# Altium project BMW F800GS Board.PrjPcb
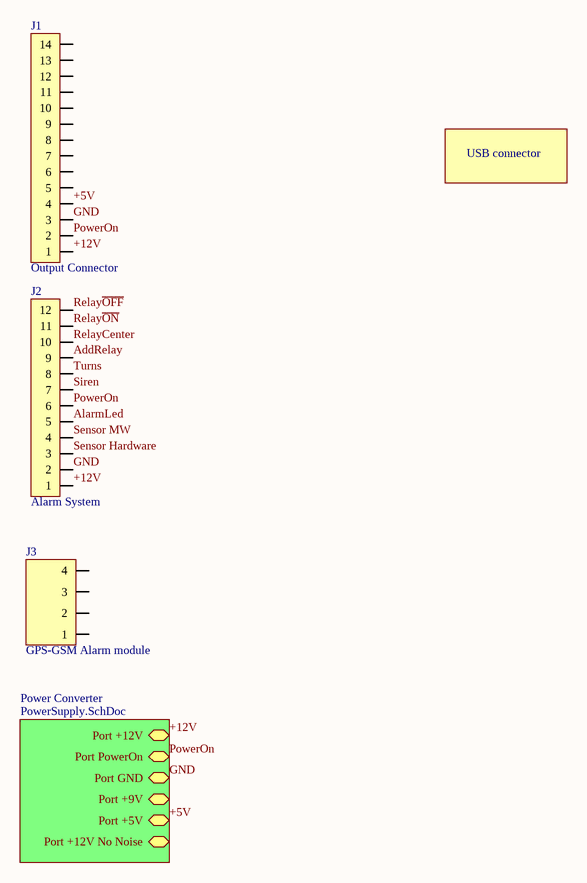
[diagram p0: BMW F800GS Board.SchDoc]
2 sheets, 16 parts. Net scope: hierarchical (ports join the sheet entries above them; power ports are global).
Board file: BMW F800GS Board.PcbDoc
Sheets:
  BMW F800GS Board.SchDoc
    Power Converter = PowerSupply.SchDoc

## Sheet BMW F800GS Board.SchDoc
size A4

### Parts
J1  Output Connector  [Molex Micro-Fit 3.0 - 14 pin D R]
J2  Alarm System  [Molex Micro-Fit 3.0 - 12 pin D R]
J3  GPS-GSM Alarm module  [Line 2.54 X 4]

### Sub-sheets
Power Converter = PowerSupply.SchDoc: Port +12V (bidir), Port GND (bidir), Port +9V (bidir), Port +5V (bidir), Port +12V No Noise, Port PowerOn

### Nets
GND: J1.3 J2.2 ; sheet Power Converter/Port GND
+5V: J1.4 ; sheet Power Converter/Port +5V
+12V: J1.1 J2.1 ; sheet Power Converter/Port +12V
AddRelay: J2.9
AlarmLed: J2.5
PowerOn: J1.2 J2.6 ; sheet Power Converter/Port PowerOn
RelayCenter: J2.10
Relay~{OFF}: J2.12
Relay~{ON}: J2.11
Sensor Hardware: J2.3
Sensor MW: J2.4
Siren: J2.7
Turns: J2.8

Not connected (* = marked no-connect by the designer): J1 5 6 7 8 9 10 11 12 13 14; J3 1 2 3 4

### Notes on the sheet
- USB connector

### Library data of the parts
J1 = Micro-Fit 14 (2x7): Horisontal, Dbl line, Male
J2 = Micro-Fit 12 (2x6): Horisontal, Dbl line, Male
J3 = PLS-4: Vert, Sgl line, Male

## Sheet PowerSupply.SchDoc
size A4
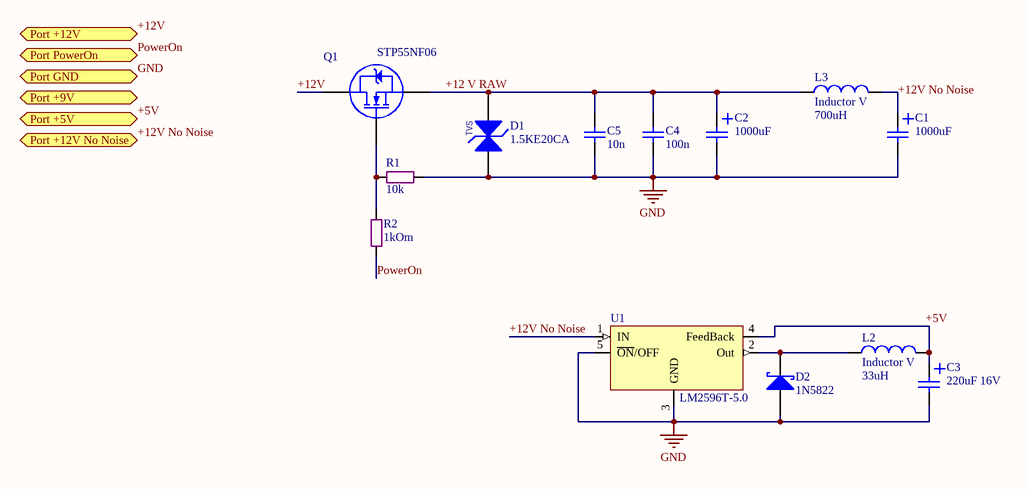
[diagram p1: PowerSupply.SchDoc]

### Parts
C1  1000uF  [Cap E p5.08mm D10.2mm (3p)]
C2  1000uF  [Cap E p5.08mm D10.2mm (3p)]
C3  220uF 16V  [Cap E p2mm D6.5xH11]
C4  100n  [Cap P5.08MM (3p) disk2]
C5  10n  [Cap P5.08MM (3p) disk2]
D1  1.5KE20CA  [TVS diode DO-201]
D2  1N5822  [Diode DO-201]
L2  Inductor V  value 33uH  [Toroid V D14-W6]
L3  Inductor V  value 700uH  [Toroid V D14-W6]
Q1  STP55NF06  [TO220-2 Horisontal]
R1  10k  [SMD 0805 (2012)]
R2  1kOm  [SMD 0805 (2012)]
U1  LM2596T-5.0  [TO220-5 Horisontal]

### Ports
Port +5V (bidir), Port +9V (bidir), Port +12V (in), Port +12V No Noise (bidir), Port GND (bidir), Port PowerOn (in)

### Nets
GND: C1.2 C2.2 C3.2 C4.2 C5.2 D1.1 D2.A R1.2 U1.3(GND) U1.5(~{ON}/OFF) ; port Port GND
+5V: C3.1 L2.2 U1.4(FeedBack) ; port Port +5V
+12 V RAW: C2.1 C4.1 C5.1 D1.2 L3.1 Q1.3(S)
+12V: Q1.2(D) ; port Port +12V
+12V No Noise: C1.1 L3.2 U1.1(IN) ; port Port +12V No Noise
PowerOn: R2.1 ; port Port PowerOn
NetD2_K: D2.K L2.1 U1.2(Out)
NetQ1_1: Q1.1(G) R1.1 R2.2

### Notes on the sheet
- (in symbol TVS 1.5KE20CA) TVS

### Library data of the parts
C1 C2 = Cap E 1000mF x 25V: Capacitor
C3 = Cap E 220mF x 16V: Capacitor; Value: 220mF 16v
C4 C5 = Cap Ceramic: Capacitor
D1 = TVS 1.5KE20CA: 1500W Transil (TVS Diode); Stand-Off V: 17.1; Load A: 5; Breakdown V: min 19 max 21; PackageReference: DO-201; Pulse Power: 1500W; VALUE: 1.5KE20CA
D2 = D Shotki 1N5822: 3 Amp Shotki  Diode; PackageReference: DO-201; VALUE: 1N5822
L2 L3 = Inductor V: Inductor Vertical; Code_IEC: 1005; Published: 8-Jun-2000; LatestRevisionDate: 29-May-2009; LatestRevisionNote: IPC-7351 Footprint Added.; PackageReference: 0402-A; Publisher: Altium Limited; PackageDescription: Chip Inductor; Code_JEITA: 0402
Q1 = STP55NF06: N-Channel 60V - 0.018Ω - 50A - D2PAK - I2PAK; Monufacturer: STP; V DSS (v): 60; RDS: <0.018Om; I d - Drain current (continuous) at TC = 25°C: 50 A; I d - Drain current (continuous) at TC = 100°C: 50 A; Name: STP55NF06
R1 R2 = Res SMD 0805
U1 = LM2596T-5.0: Voltage Regulator; Manufacturer: National Semiconductor; I output (A): 3; Max Voltage In (V): 40; Name: LM2596T-5.0; Case: TO220-5

## Nets that join several sheets
GND: BMW F800GS Board (J1.3 J2.2), PowerSupply (10 pins)
+5V: BMW F800GS Board (J1.4), PowerSupply (C3.1 L2.2 U1.4)
+12V: BMW F800GS Board (J1.1 J2.1), PowerSupply (Q1.2)
PowerOn: BMW F800GS Board (J1.2 J2.6), PowerSupply (R2.1)